# EAGLE design scanner (EAGLE 6.5.0)
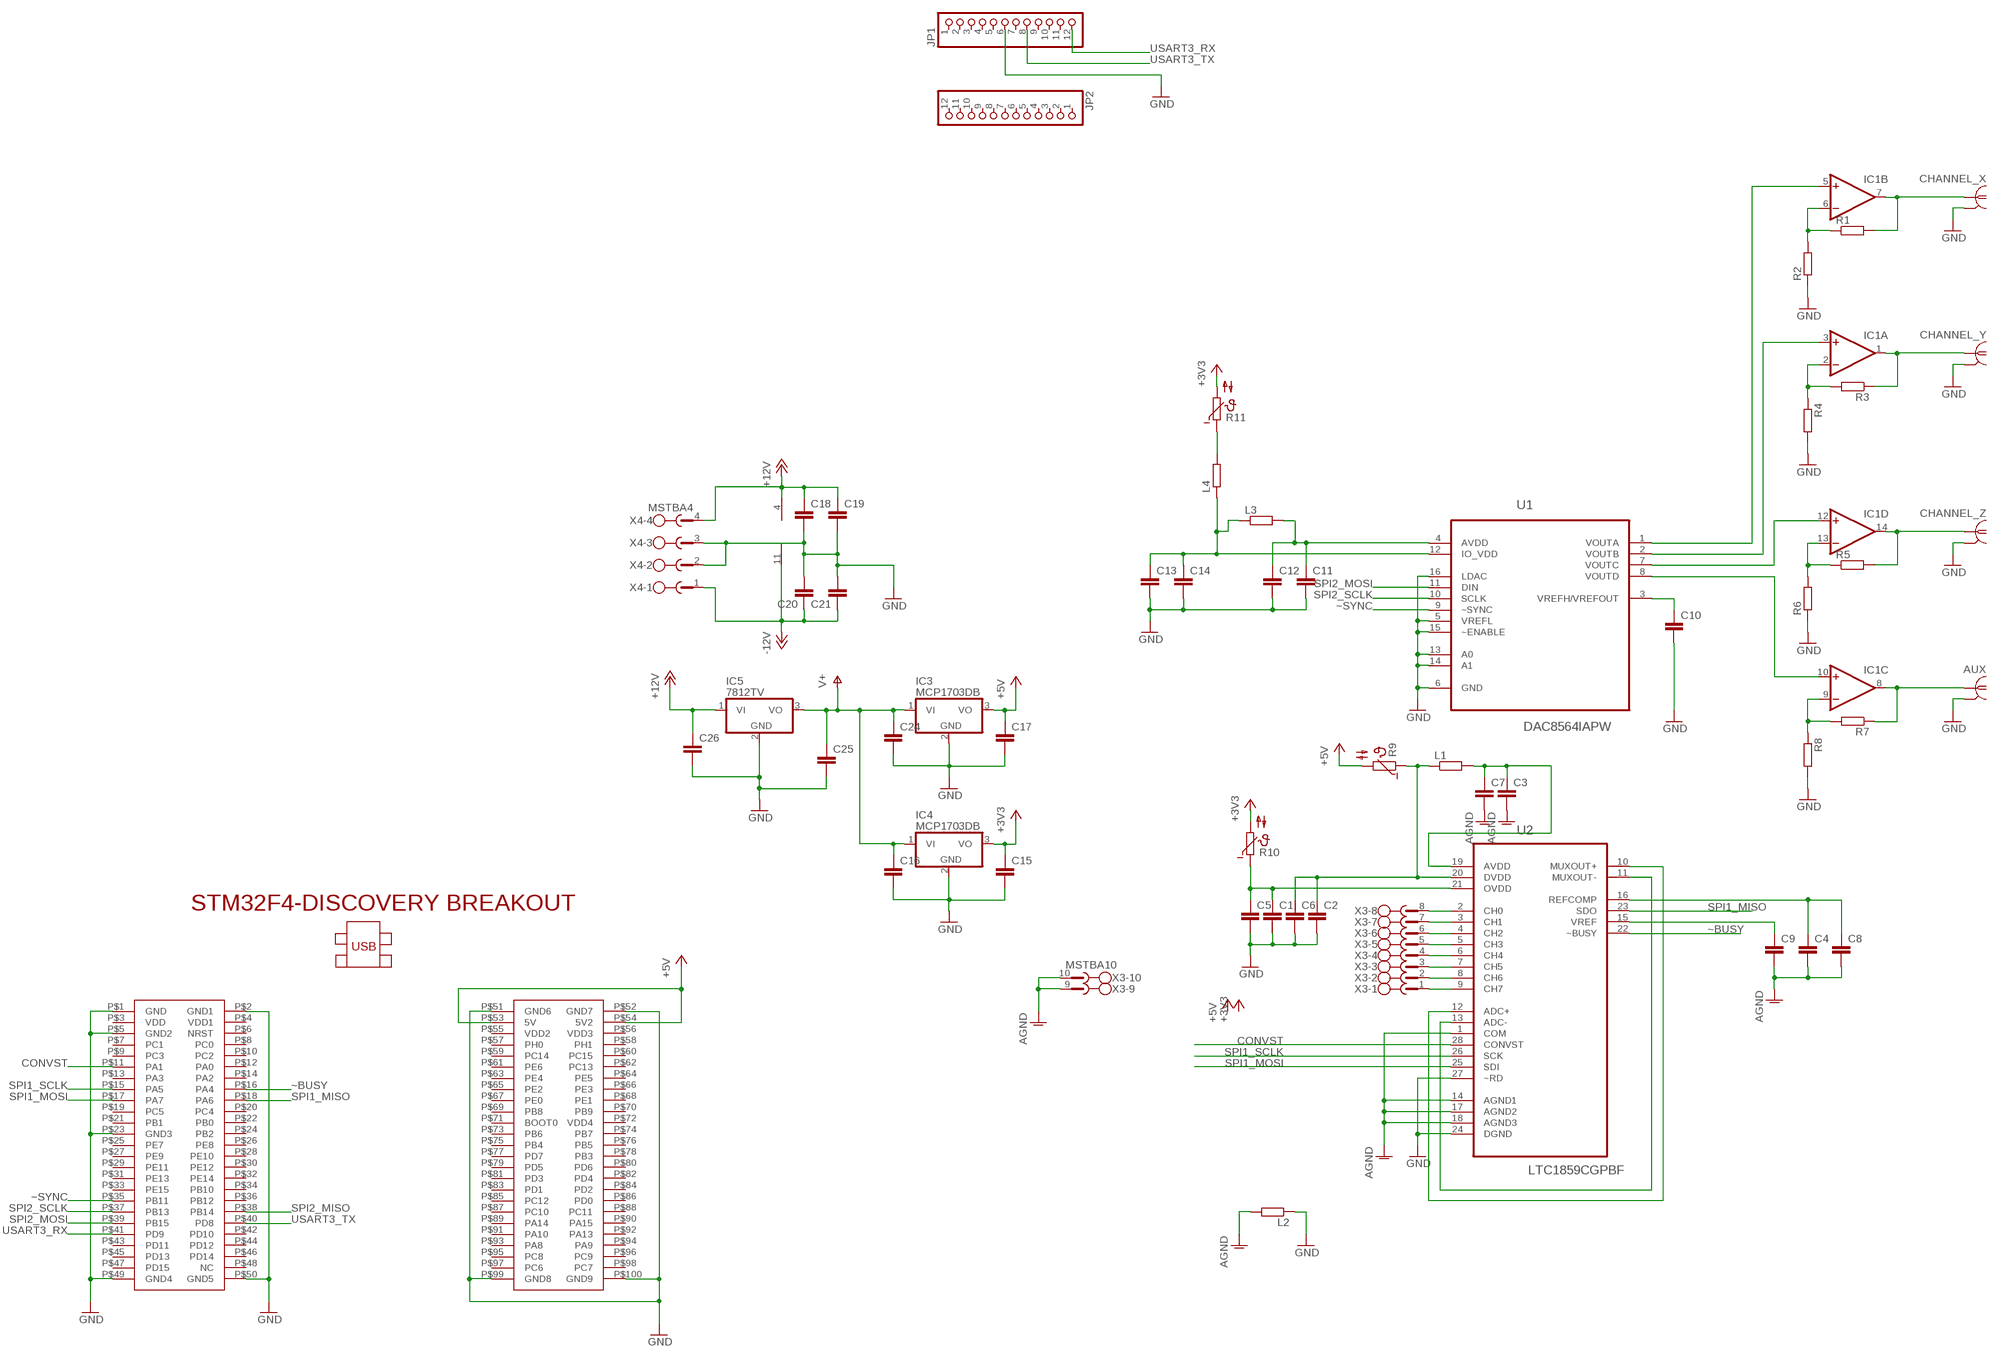
[diagram p0: schematic, sheet 1]

## Parts
AUX  1-227161-0  [AMP_227161]
C1  C-EUC0805  [C0805]
C2  C-EUC0805  [C0805]
C3  C-EUC0805  [C0805]
C4  C-EUC0805  [C0805]
C5  C-EUC1206  [C1206]
C6  C-EUC1206  [C1206]
C7  C-EUC1206  [C1206]
C8  C-EUC1206  [C1206]
C9  C-EUC1206  [C1206]
C10  C-EUC0805  [C0805]
C11  C-EUC0805  [C0805]
C12  C-EUC1206  [C1206]
C13  C-EUC1206  [C1206]
C14  C-EUC0805  [C0805]
C15  C-EUC0805  [C0805]
C16  C-EUC0805  [C0805]
C17  C-EUC0805  [C0805]
C18  C-EUC1206  [C1206]
C19  C-EUC0805  [C0805]
C20  C-EUC1206  [C1206]
C21  C-EUC0805  [C0805]
C24  C-EUC0805  [C0805]
C25  C-EUC1206  [C1206]
C26  C-EUC1206  [C1206]
CHANNEL_X  1-227161-0  [AMP_227161]
CHANNEL_Y  1-227161-0  [AMP_227161]
CHANNEL_Z  1-227161-0  [AMP_227161]
IC1  4AMP_P4+11D  [SO14]
IC3  MCP1703DB  [SOT223]
IC4  MCP1703DB  [SOT223]
IC5  7812TV  [TO220V]
JP1  PINHD-1X12  [1X12]
JP2  PINHD-1X12  [1X12]
L1  R-EU_M1206  [M1206]
L2  R-EU_M1206  [M1206]
L3  R-EU_M1206  [M1206]
L4  R-EU_M1206  [M1206]
R1  R-EU_M0805  [M0805]
R2  R-EU_M0805  [M0805]
R3  R-EU_M0805  [M0805]
R4  R-EU_M0805  [M0805]
R5  R-EU_M0805  [M0805]
R6  R-EU_M0805  [M0805]
R7  R-EU_M0805  [M0805]
R8  R-EU_M0805  [M0805]
R9  NTC644C  [N644C]
R10  NTC644C  [N644C]
R11  NTC644C  [N644C]
U1  DAC8564IAPW  [SOP65P640X120-16N]
U2  LTC1859CGPBF  [SOP65P780X200-28N]
U$2  STM32F4-DISCOVERY  [STM32F4-DISCOVERY]
X3  MSTBA10  [MSTBA10]
X4  MSTBA4  [MSTBA4]

## Nets
+3V3: C15.1 IC4.3(VO) R10.2 R11.2
+5V: C17.1 IC3.3(VO) R9.2 U$2.P$53(5V) U$2.P$54(5V2)
+12V: C18.1 C19.1 C26.1 IC1.4(P:V+) IC5.1(VI) X4.4
-12V: C20.1 C21.1 IC1.11(P:V-) X4.1
AGND: C3.2 C4.2 C7.2 C8.2 C9.2 L2.2 U2.1(COM) U2.14(AGND1) U2.17(AGND2) U2.18(AGND3) X3.9 X3.10
AVCC: C3.1 C7.1 L1.2 U2.19(AVDD)
CONVST: U2.28(CONVST) U$2.P$11(PA1)
GND: AUX.2 C1.2 C2.2 C5.2 C6.2 C10.2 C11.2 C12.2 C13.2 C14.2 C15.2 C16.2 C17.2 C18.2 C19.2 C20.2 C21.2 C24.2 C25.2 C26.2 CHANNEL_X.2 CHANNEL_Y.2 CHANNEL_Z.2 IC3.2(GND) IC4.2(GND) IC5.2(GND) JP1.6 L2.1 R2.1 R4.2 R6.1 R8.2 U1.5(VREFL) U1.6(GND) U1.13(A0) U1.14(A1) U1.15(~ENABLE) U1.16(LDAC) U2.24(DGND) U2.27(~RD) U$2.P$1(GND) U$2.P$2(GND1) U$2.P$5(GND2) U$2.P$23(GND3) U$2.P$49(GND4) U$2.P$50(GND5) U$2.P$51(GND6) U$2.P$52(GND7) U$2.P$99(GND8) U$2.P$100(GND9) X4.2 X4.3
N$1: U2.10(MUXOUT+) U2.12(ADC+)
N$2: U2.11(MUXOUT-) U2.13(ADC-)
N$3: IC1.5(B:+IN) U1.1(VOUTA)
N$4: C9.1 U2.15(VREF)
N$5: C4.1 C8.1 U2.16(REFCOMP)
N$6: U2.3(CH1) X3.7
N$7: U2.2(CH0) X3.8
N$8: U2.4(CH2) X3.6
N$9: U2.5(CH3) X3.5
N$10: U2.6(CH4) X3.4
N$11: U2.7(CH5) X3.3
N$12: U2.8(CH6) X3.2
N$13: U2.9(CH7) X3.1
N$14: IC1.3(A:+IN) U1.2(VOUTB)
N$15: IC1.12(D:+IN) U1.7(VOUTC)
N$16: IC1.10(C:+IN) U1.8(VOUTD)
N$17: C10.1 U1.3(VREFH/VREFOUT)
N$18: CHANNEL_X.1 IC1.7(B:OUT) R1.2
N$19: IC1.6(B:-IN) R1.1 R2.2
N$20: CHANNEL_Y.1 IC1.1(A:OUT) R3.1
N$21: IC1.2(A:-IN) R3.2 R4.1
N$22: C13.1 C14.1 L3.1 L4.1 U1.12(IO_VDD)
N$23: CHANNEL_Z.1 IC1.14(D:OUT) R5.2
N$24: IC1.13(D:-IN) R5.1 R6.2
N$25: AUX.1 IC1.8(C:OUT) R7.1
N$26: IC1.9(C:-IN) R7.2 R8.1
N$27: C11.1 C12.1 L3.2 U1.4(AVDD)
N$28: L4.2 R11.1
N$29: C2.1 C6.1 L1.1 R9.1 U2.20(DVDD)
N$30: C1.1 C5.1 R10.1 U2.21(OVDD)
SPI1_MISO: U2.23(SDO) U$2.P$18(PA6)
SPI1_MOSI: U2.25(SDI) U$2.P$17(PA7)
SPI1_SCLK: U2.26(SCK) U$2.P$15(PA5)
SPI2_MISO: U$2.P$38(PB14)
SPI2_MOSI: U1.11(DIN) U$2.P$39(PB15)
SPI2_SCLK: U1.10(SCLK) U$2.P$37(PB13)
USART3_RX: JP1.12 U$2.P$41(PD9)
USART3_TX: JP1.8 U$2.P$40(PD8)
V+: C16.1 C24.1 C25.1 IC3.1(VI) IC4.1(VI) IC5.3(VO)
~BUSY: U2.22(~BUSY) U$2.P$16(PA4)
~SYNC: U1.9(~SYNC) U$2.P$35(PB11)
Unconnected: JP1.1 JP1.2 JP1.3 JP1.4 JP1.5 JP1.7 JP1.9 JP1.10 JP1.11 JP2.1 JP2.2 JP2.3 JP2.4 JP2.5 JP2.6 JP2.7 JP2.8 JP2.9 JP2.10 JP2.11 JP2.12 U$2.P$3(VDD) U$2.P$4(VDD1) U$2.P$6(NRST) U$2.P$7(PC1) U$2.P$8(PC0) U$2.P$9(PC3) U$2.P$10(PC2) U$2.P$12(PA0) U$2.P$13(PA3) U$2.P$14(PA2) U$2.P$19(PC5) U$2.P$20(PC4) U$2.P$21(PB1) U$2.P$22(PB0) U$2.P$24(PB2) U$2.P$25(PE7) U$2.P$26(PE8) U$2.P$27(PE9) U$2.P$28(PE10) U$2.P$29(PE11) U$2.P$30(PE12) U$2.P$31(PE13) U$2.P$32(PE14) U$2.P$33(PE15) U$2.P$34(PB10) U$2.P$36(PB12) U$2.P$42(PD10) U$2.P$43(PD11) U$2.P$44(PD12) U$2.P$45(PD13) U$2.P$46(PD14) U$2.P$47(PD15) U$2.P$48(NC) U$2.P$55(VDD2) U$2.P$56(VDD3) U$2.P$57(PH0) U$2.P$58(PH1) U$2.P$59(PC14) U$2.P$60(PC15) U$2.P$61(PE6) U$2.P$62(PC13) U$2.P$63(PE4) U$2.P$64(PE5) U$2.P$65(PE2) U$2.P$66(PE3) U$2.P$67(PE0) U$2.P$68(PE1) U$2.P$69(PB8) U$2.P$70(PB9) U$2.P$71(BOOT0) U$2.P$72(VDD4) U$2.P$73(PB6) U$2.P$74(PB7) U$2.P$75(PB4) U$2.P$76(PB5) U$2.P$77(PD7) U$2.P$78(PB3) U$2.P$79(PD5) U$2.P$80(PD6) U$2.P$81(PD3) U$2.P$82(PD4) U$2.P$83(PD1) U$2.P$84(PD2) U$2.P$85(PC12) U$2.P$86(PD0) U$2.P$87(PC10) U$2.P$88(PC11) U$2.P$89(PA14) U$2.P$90(PA15) U$2.P$91(PA10) U$2.P$92(PA13) U$2.P$93(PA8) U$2.P$94(PA9) U$2.P$95(PC8) U$2.P$96(PC9) U$2.P$97(PC6) U$2.P$98(PC7)

## Library data of the parts
AUX CHANNEL_X CHANNEL_Y CHANNEL_Z = con-coax:?227161*: JACK, RIGHT ANGLE, 50 OHM, PCB, BNC Source: amp_227161.pdf; MF: TYCO ELECTRONICS; MPN: 1-227161; OC_FARNELL: unknown; OC_NEWARK: 33B3200
C1-C21 C24-C26 = resistor:C-EU: CAPACITOR, European symbol
IC1 = linear:4AMP_P4+11: OP AMP
IC3 IC4 = linear:MCP1703: 250 mA, 16V, Low Quiescent Current LDO Regulator Source: http://ww1.microchip.com/downloads/en/DeviceDoc/22049b.pdf
IC5 = linear:78*: Positive VOLTAGE REGULATOR Source: http://cache.national.com/ds/LM/LM78L05.pdf http://www.fairchildsemi.com/ds/LM/LM7805.pdf
JP1 JP2 = pinhead:PINHD-1X12: PIN HEADER
L1-L4 R1-R8 = resistor:R-EU_: RESISTOR, European symbol
R9-R11 = ptc-ntc:NTC644C: PHILIPS NTC; OC_FARNELL: unknown; OC_NEWARK: unknown
U1 = DAC8564:DAC8564IAPW: DAC; MPN: DAC8564IAPW; OC_FARNELL: 1536691; OC_NEWARK: 65M0703; PACKAGE: TSSOP-16; SUPPLIER: Texas Instruments
U2 = ltc1859:LTC1859CGPBF: 16 Bit ADC; MPN: LTC1859CG#PBF; OC_FARNELL: 1898592; OC_NEWARK: 56M4002; PACKAGE: SSOP-28; SUPPLIER: Linear Technology
U$2 = stm32full:STM32F4-DISCOVERY
X3 = con-phoenix-508:MSTBA10: PHOENIX; MF: FARNELL; MPN: 1757323; OC_FARNELL: 3705249; OC_NEWARK: 71C4168
X4 = con-phoenix-508:MSTBA4: PHOENIX; MF: FARNELL; MPN: 1757268; OC_FARNELL: 3705195; OC_NEWARK: 71C4163

## Board
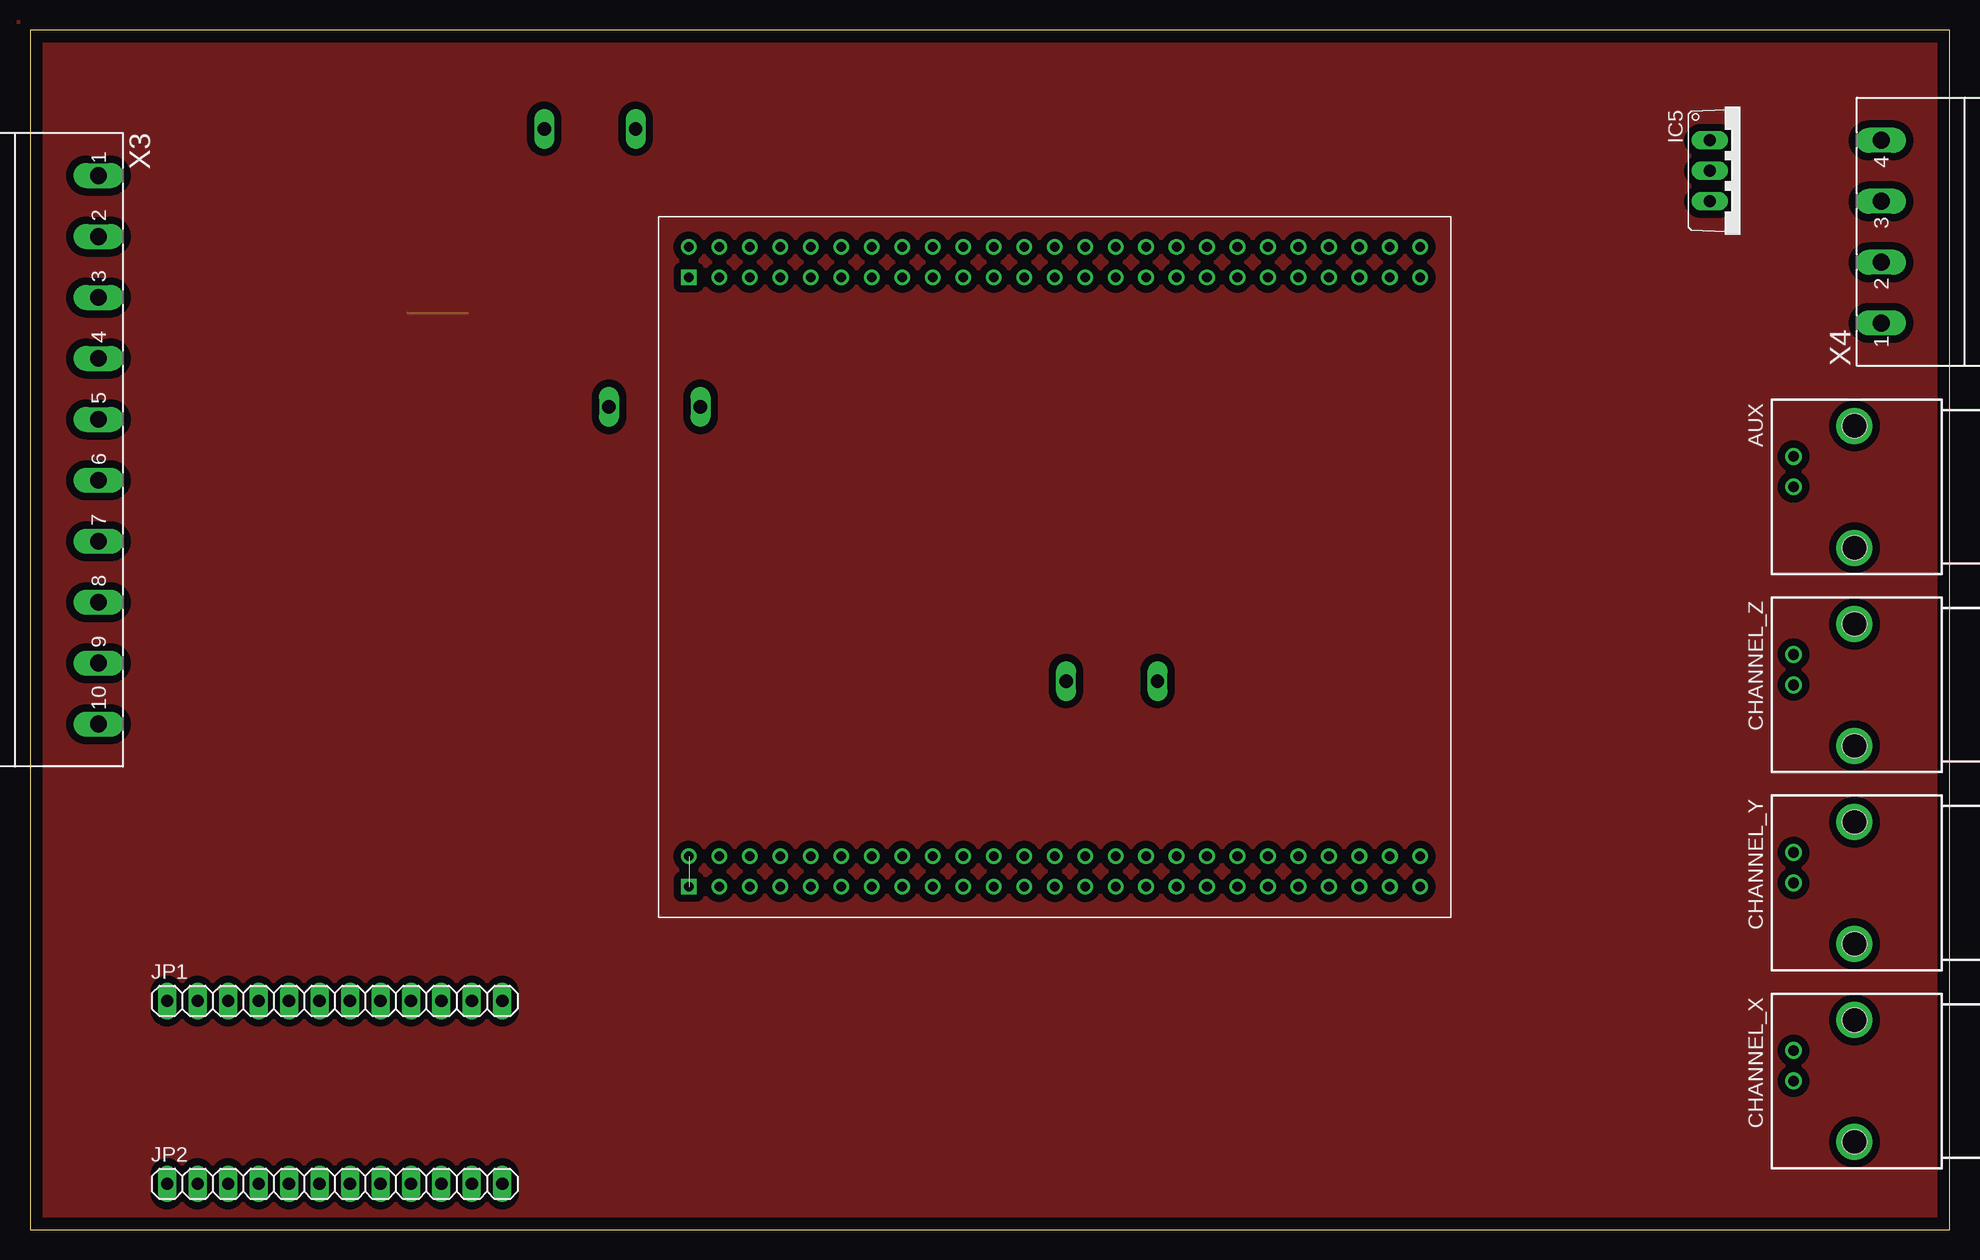
[diagram p1: board, top side]
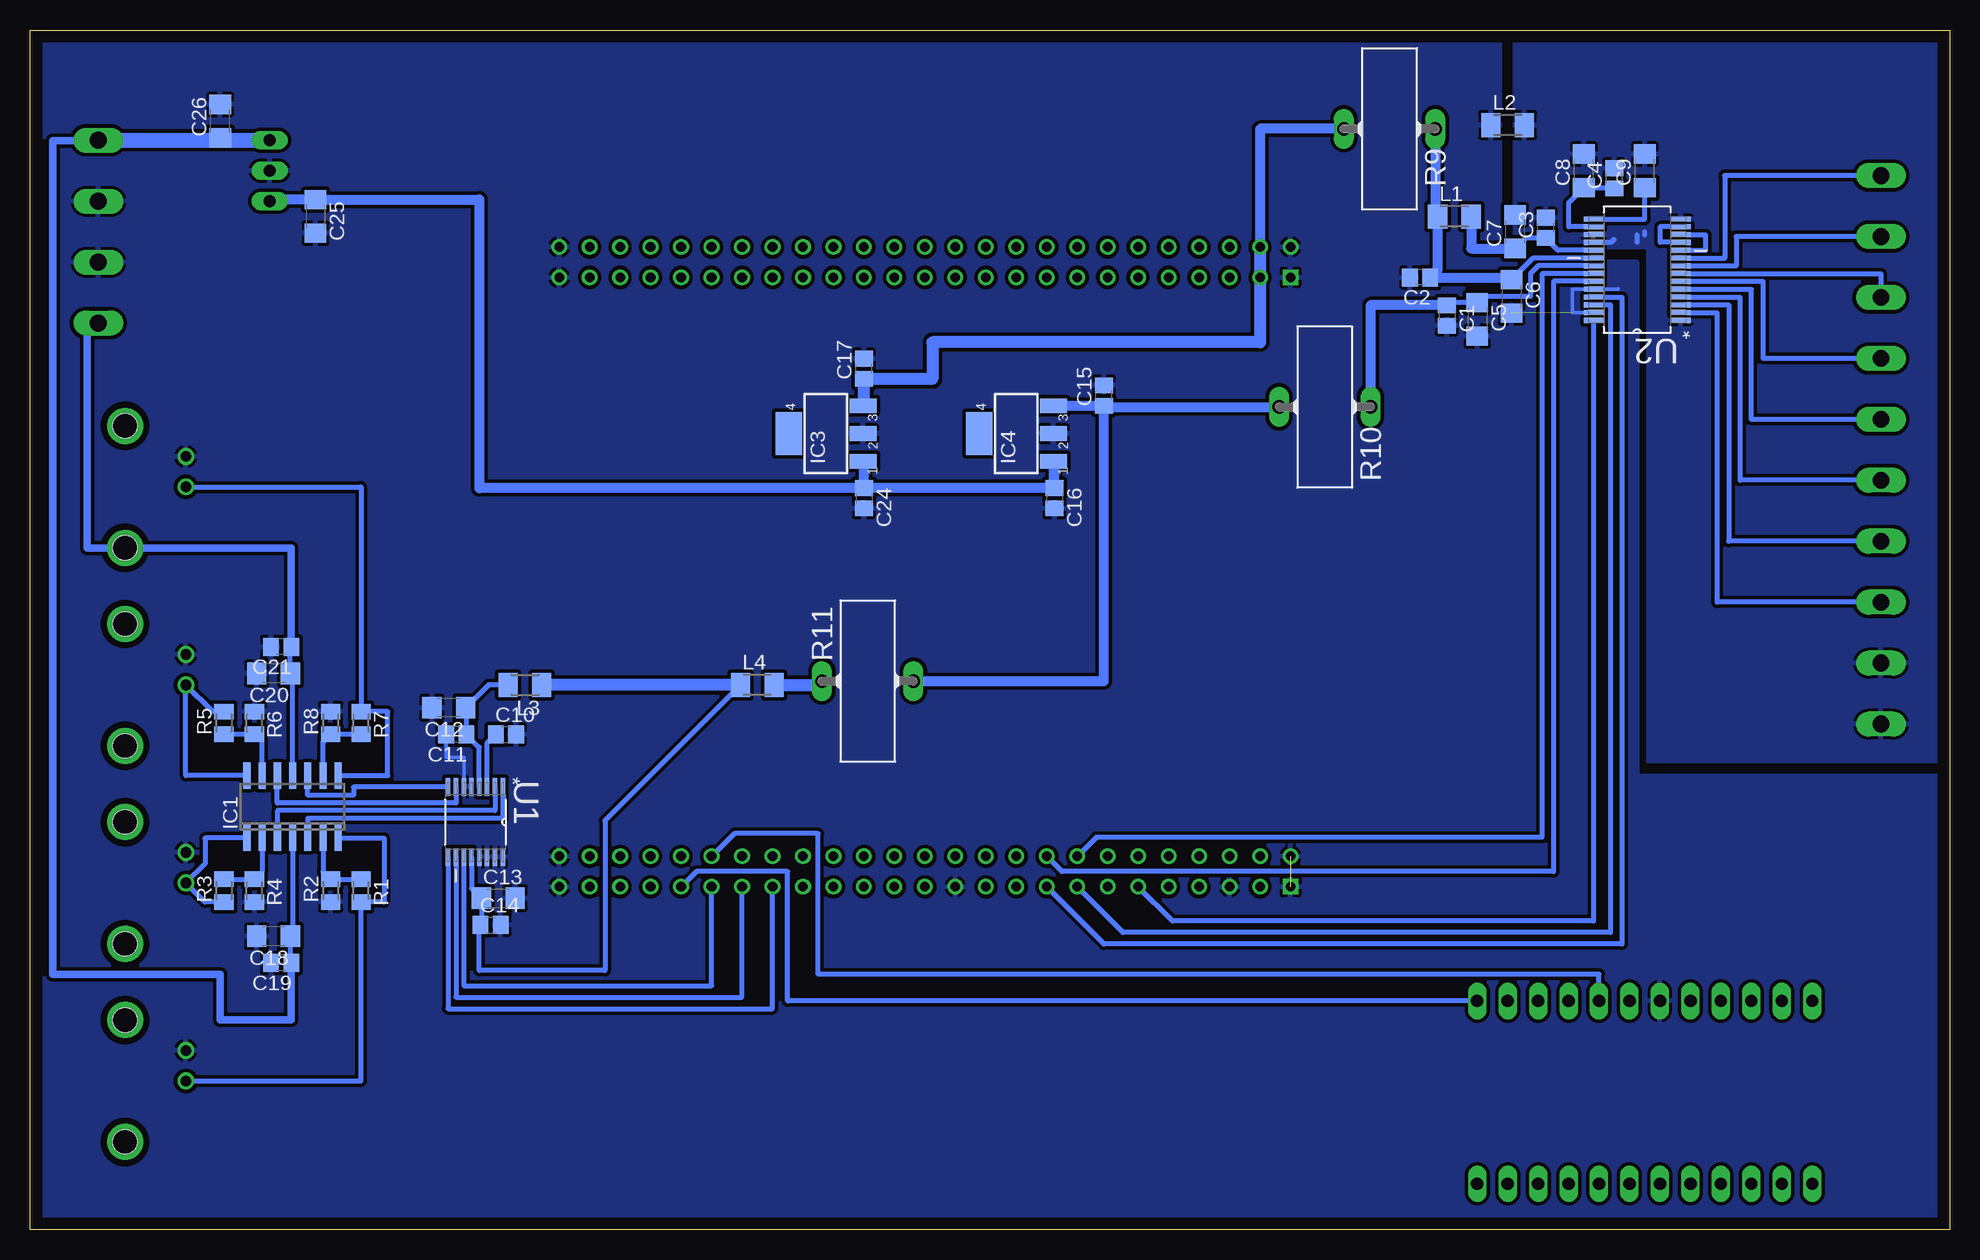
[diagram p2: board, bottom side, seen from below]

Size 160 x 100 mm. Coordinates in mm from the lower left corner, seen from the top.
Outline: 0,0 160,0 160,100 0,100 0,0
Copper layers (1*16): Top 0.035mm / dielectric 1.5mm / Bottom 0.035mm
Design rules "default": minimum track width 10mil, minimum drill 24mil, track to track 8mil, track to pad 8mil, pad to pad 8mil, via to via 8mil, smd to smd 8mil, copper to edge 40mil, drill to drill 8mil, minimum pad ring 10mil, minimum via ring 8mil, stop-mask expansion 4mil, vias tented up to drill 0mil, thermal gap 10mil

### Footprints (pad centres in the part's own frame; a part is rotated, then mirrored left to right if it is on the bottom)
AMP_227161 = drill 0.9 pad 1.27: 1 0,-5.08; 2 -2.54,-5.08 | drill 2: P$1 -5.08,0; P$2 5.08,0 | hole 2: -5.08,0; 5.08,0
C0805 = smd 1.3 x 1.5: 1 -0.85,0; 2 0.85,0
C1206 = smd 1.6 x 1.8: 1 -1.4,0; 2 1.4,0
SO14 = smd 0.6 x 2.2: 1 -3.81,-2.6; 2 -2.54,-2.6; 3 -1.27,-2.6; 4 0,-2.6; 5 1.27,-2.6; 6 2.54,-2.6; 7 3.81,-2.6; 8 3.81,2.6; 9 2.54,2.6; 10 1.27,2.6; 11 0,2.6; 12 -1.27,2.6; 13 -2.54,2.6; 14 -3.81,2.6
SOT223 = smd 1.219 x 2.235: 1 -2.311,-3.099; 2 0,-3.099; 3 2.311,-3.099 | smd 3.6 x 2.2: 4 0,3.099
TO220V = drill 1.016 long: 1 -2.54,-2.54; 2 0,-2.54; 3 2.54,-2.54
1X12 = drill 1.016 long: 1 -13.97,0; 2 -11.43,0; 3 -8.89,0; 4 -6.35,0; 5 -3.81,0; 6 -1.27,0; 7 1.27,0; 8 3.81,0; 9 6.35,0; 10 8.89,0; 11 11.43,0; 12 13.97,0
M1206 = smd 1.6 x 2: 1 -1.4,0; 2 1.4,0
M0805 = smd 1.3 x 1.6: 1 -0.95,0; 2 0.95,0
N644C = drill 1.118 long: 1 -3.81,0; 2 3.81,0
SOP65P640X120-16N = smd 1.473 x 0.356: 1 -2.921,2.286; 2 -2.921,1.626; 3 -2.921,0.965; 4 -2.921,0.33; 5 -2.921,-0.33; 6 -2.921,-0.965; 7 -2.921,-1.626; 8 -2.921,-2.286; 9 2.921,-2.286; 10 2.921,-1.626; 11 2.921,-0.965; 12 2.921,-0.33; 13 2.921,0.33; 14 2.921,0.965; 15 2.921,1.626; 16 2.921,2.286
SOP65P780X200-28N = smd 1.651 x 0.432: 1 -3.632,4.216; 2 -3.632,3.581; 3 -3.632,2.921; 4 -3.632,2.286; 5 -3.632,1.626; 6 -3.632,0.965; 7 -3.632,0.33; 8 -3.632,-0.33; 9 -3.632,-0.965; 10 -3.632,-1.626; 11 -3.632,-2.286; 12 -3.632,-2.921; 13 -3.632,-3.581; 14 -3.632,-4.216; 15 3.632,-4.216; 16 3.632,-3.581; 17 3.632,-2.921; 18 3.632,-2.286; 19 3.632,-1.626; 20 3.632,-0.965; 21 3.632,-0.33; 22 3.632,0.33; 23 3.632,0.965; 24 3.632,1.626; 25 3.632,2.286; 26 3.632,2.921; 27 3.632,3.581; 28 3.632,4.216
STM32F4-DISCOVERY = drill 0.8 square: P$1 -27.94,30.48; P$51 22.86,30.48 | drill 0.8: P$2 -25.4,30.48; P$3 -27.94,27.94; P$4 -25.4,27.94; P$5 -27.94,25.4; P$6 -25.4,25.4; P$7 -27.94,22.86; P$8 -25.4,22.86; P$9 -27.94,20.32; P$10 -25.4,20.32; P$11 -27.94,17.78; P$12 -25.4,17.78; P$13 -27.94,15.24; P$14 -25.4,15.24; P$15 -27.94,12.7; P$16 -25.4,12.7; P$17 -27.94,10.16; P$18 -25.4,10.16; P$19 -27.94,7.62; P$20 -25.4,7.62; P$21 -27.94,5.08; P$22 -25.4,5.08; P$23 -27.94,2.54; P$24 -25.4,2.54; P$25 -27.94,0; P$26 -25.4,0; P$27 -27.94,-2.54; P$28 -25.4,-2.54; P$29 -27.94,-5.08; P$30 -25.4,-5.08; P$31 -27.94,-7.62; P$32 -25.4,-7.62; P$33 -27.94,-10.16; P$34 -25.4,-10.16; P$35 -27.94,-12.7; P$36 -25.4,-12.7; P$37 -27.94,-15.24; P$38 -25.4,-15.24; P$39 -27.94,-17.78; P$40 -25.4,-17.78; P$41 -27.94,-20.32; P$42 -25.4,-20.32; P$43 -27.94,-22.86; P$44 -25.4,-22.86; P$45 -27.94,-25.4; P$46 -25.4,-25.4; P$47 -27.94,-27.94; P$48 -25.4,-27.94; P$49 -27.94,-30.48; P$50 -25.4,-30.48; P$52 25.4,30.48; P$53 22.86,27.94; P$54 25.4,27.94; P$55 22.86,25.4; P$56 25.4,25.4; P$57 22.86,22.86; P$58 25.4,22.86; P$59 22.86,20.32; P$60 25.4,20.32; P$61 22.86,17.78; P$62 25.4,17.78; P$63 22.86,15.24; P$64 25.4,15.24; P$65 22.86,12.7; P$66 25.4,12.7; P$67 22.86,10.16; P$68 25.4,10.16; P$69 22.86,7.62; P$70 25.4,7.62; P$71 22.86,5.08; P$72 25.4,5.08; P$73 22.86,2.54; P$74 25.4,2.54; P$75 22.86,0; P$76 25.4,0; P$77 22.86,-2.54; P$78 25.4,-2.54; P$79 22.86,-5.08; P$80 25.4,-5.08; P$81 22.86,-7.62; P$82 25.4,-7.62; P$83 22.86,-10.16; P$84 25.4,-10.16; P$85 22.86,-12.7; P$86 25.4,-12.7; P$87 22.86,-15.24; P$88 25.4,-15.24; P$89 22.86,-17.78; P$90 25.4,-17.78; P$91 22.86,-20.32; P$92 25.4,-20.32; P$93 22.86,-22.86; P$94 25.4,-22.86; P$95 22.86,-25.4; P$96 25.4,-25.4; P$97 22.86,-27.94; P$98 25.4,-27.94; P$99 22.86,-30.48; P$100 25.4,-30.48
MSTBA10 = drill 1.397 long: 1 -22.86,5.08; 2 -17.78,5.08; 3 -12.7,5.08; 4 -7.62,5.08; 5 -2.54,5.08; 6 2.54,5.08; 7 7.62,5.08; 8 12.7,5.08; 9 17.78,5.08; 10 22.86,5.08
MSTBA4 = drill 1.397 long: 1 -7.62,5.08; 2 -2.54,5.08; 3 2.54,5.08; 4 7.62,5.08

### Placement (x,y rotation side)
AUX  152.08,61.91 270 top
C1  41.91,76.2 270 bottom
C2  44.13,79.38 180 bottom
C3  33.66,83.5 90 bottom
C4  27.94,87.63 90 bottom
C5  39.37,75.88 270 bottom
C6  36.51,77.79 270 bottom
C7  36.2,83.19 90 bottom
C8  30.48,88.27 90 bottom
C9  25.4,88.27 90 bottom
C10  120.33,41.27 0 bottom
C11  124.46,41.27 180 bottom
C12  125.09,43.5 180 bottom
C13  120.97,27.62 0 bottom
C14  121.6,25.4 0 bottom
C15  70.48,69.53 90 bottom
C16  74.61,60.96 270 bottom
C17  90.49,71.75 90 bottom
C18  139.7,24.45 180 bottom
C19  139.06,22.23 180 bottom
C20  139.7,46.35 180 bottom
C21  139.06,48.58 180 bottom
C24  90.49,60.96 270 bottom
C25  136.21,84.45 270 bottom
C26  144.15,92.39 90 bottom
CHANNEL_X  152.08,12.38 270 top
CHANNEL_Y  152.08,28.89 270 top
CHANNEL_Z  152.08,45.4 270 top
IC1  138.11,35.24 0 bottom
IC3  93.66,66.36 90 bottom
IC4  77.79,66.36 90 bottom
IC5  142.56,88.27 270 top
JP1  25.4,19.05 0 top
JP2  25.4,3.81 0 top
L1  41.27,84.45 0 bottom
L2  36.83,92.08 0 bottom
L3  118.75,45.4 180 bottom
L4  99.38,45.4 0 bottom
R1  132.4,28.26 270 bottom
R2  134.94,28.26 90 bottom
R3  143.83,28.26 90 bottom
R4  141.29,28.26 270 bottom
R5  143.83,42.23 90 bottom
R6  141.29,42.23 270 bottom
R7  132.4,42.23 270 bottom
R8  134.94,42.23 90 bottom
R9  46.67,91.76 180 bottom
R10  52.07,68.58 180 bottom
R11  90.17,45.72 0 bottom
U1  122.87,33.97 270 bottom
U2  26.04,80.01 180 bottom
U$2  85.41,56.52 90 top
X3  0.64,65 270 top
X4  159.38,83.19 90 top

### Tracks (layer width: path | path; a pad name or v marks a point on that pad's centre or on a via)
+3V3
  Bottom 0.406: 74.61,68.67 IC4.3
  Bottom 0.813: 74.61,68.67 70.48,68.67 C15.1 | C15.1 70.38,68.58 R10.2 | R11.2 70.48,45.72 C15.1
+5V
  Bottom 0.813: R9.2 57.47,91.76 U$2.P$54
  Bottom 1.016: U$2.P$54 U$2.P$53 57.47,73.98 84.77,73.98 84.77,70.91 C17.1 90.49,68.67 IC3.3
+12V
  Bottom 0.406: IC1.4 138.11,24.45 C18.1 138.3,22.23 C19.1
  Bottom 0.61: C19.1 138.22,17.46 144.15,17.46 144.15,21.27 158.12,21.27 158.12,90.78 154.01,90.78 X4.4
  Bottom 0.813: C26.1 140.02,90.99 IC5.1
  Bottom 1.27: X4.4 IC5.1
-12V
  Bottom 0.406: IC1.11 138.11,46.35 C20.1 138.3,48.58 C21.1
  Bottom 0.61: C21.1 138.22,56.83 155.23,56.83 155.23,75.56 X4.1
AGND
  Bottom 0.406: 25.4,82.93 25.4,83.19 | 26.04,82.3 26.04,82.93 | 27.94,82.55 28.19,82.3 U2.18
  pour Bottom (isolate 0.305): 0,39.05 25.08,39.05 25.08,81.92 36.2,81.92 36.2,99.69 0,99.69
AVCC
  Bottom 0.406: 36.11,81.7 C7.1 35.33,82.65 C3.1 32.64,81.64 U2.19
  Bottom 0.813: L1.2 39.88,81.78 C7.1
CONVST
  Bottom 0.406: U2.28 29.67,25.72 64.77,25.72 U$2.P$11
GND  (2 unrouted)
  Bottom 0.305: U2.27 31.43,76.43 31.43,78.38 U2.24 27.62,78.38 27.62,78.42 | U1.6 123.83,36.89 123.83,39.37 125.31,39.37 C11.2
  pour Bottom (isolate 0.305): 37.47,100.01 160.02,100.01 160.02,0 0,0 0,37.78 26.04,37.78 26.04,80.64 37.47,80.64
N$1
  Bottom 0.406: U2.12 20.32,82.93 20.32,81.64 U2.10
N$2
  Bottom 0.406: U2.13 24.13,83.59 24.13,82.3 U2.11
N$3
  Bottom 0.406: U1.1 120.59,34.29 136.84,34.29 IC1.5
N$4
  Bottom 0.406: U2.15 25.4,84.23 C9.1
N$5
  Bottom 0.406: U2.16 31.75,83.59 31.75,85.59 C8.1 28.02,86.86 C4.1
N$6
  Bottom 0.406: U2.3 18.41,77.09 18.41,57.38 X3.7
N$7
  Bottom 0.406: U2.2 19.37,76.43 19.37,52.3 X3.8
N$8
  Bottom 0.406: U2.4 17.46,77.72 17.46,62.46 X3.6
N$9
  Bottom 0.406: U2.5 16.51,78.38 16.51,67.54 X3.5
N$10
  Bottom 0.406: U2.6 15.56,79.05 15.56,72.62 X3.4
N$11
  Bottom 0.406: U2.7 5.71,79.68 X3.3
N$12
  Bottom 0.406: U2.8 17.78,80.34 17.78,82.78 X3.2
N$13
  Bottom 0.406: U2.9 18.73,80.97 18.73,87.86 X3.1
N$14
  Bottom 0.406: U1.2 121.25,34.92 139.38,34.92 IC1.3
N$15
  Bottom 0.406: U1.7 124.5,35.56 139.38,35.56 IC1.12
N$16
  Bottom 0.406: U1.8 133.03,36.89 133.03,36.2 136.84,36.2 IC1.10
N$17
  Bottom 0.406: U1.3 121.91,40.55 C10.1
N$18
  Bottom 0.406: IC1.7 130.49,32.64 130.49,27.3 R1.2 132.4,12.38 CHANNEL_X.1
N$19
  Bottom 0.406: R1.1 R2.2 135.57,29.84 IC1.6
N$20
  Bottom 0.406: IC1.1 145.41,32.64 145.41,30.48 CHANNEL_Y.1 145.42,27.31 R3.1
N$21
  Bottom 0.406: R3.2 R4.1 140.65,29.84 IC1.2
N$22
  Bottom 0.406: U1.12 123.2,28.46 C13.1 122.37,25.48 C14.1 122.56,25.3 122.56,21.59 112.08,21.59 112.08,34.1 L4.1
  Bottom 1.016: L4.1 L3.1
N$23
  Bottom 0.406: IC1.14 147,37.84 CHANNEL_Z.1 144.78,43.18 R5.2
N$24
  Bottom 0.406: IC1.13 140.65,40.64 R6.2 R5.1
N$25
  Bottom 0.406: IC1.8 130.18,37.84 130.18,43.18 R7.1 132.4,61.91 AUX.1
N$26
  Bottom 0.406: R7.2 R8.1 135.57,40.64 IC1.9
N$27
  Bottom 0.406: U1.4 122.54,40.21 C11.1 123.61,43.41 C12.1 121.79,45.4 L3.2
N$28
  Bottom 1.016: L4.2 93.98,45.4 R11.1
N$29
  Bottom 0.406: U2.20 34.73,80.97 C6.1
  Bottom 0.813: C6.1 36.51,79.38 C2.1 42.67,79.98 L1.1 42.86,84.45 R9.1
N$30
  Bottom 0.406: U2.21 34.28,80.34 34.92,79.69 34.92,77.79 38.55,77.79 C5.1 41.68,77.28 C1.1
  Bottom 0.813: C1.1 48.26,77.05 R10.1
N$31
  pour Top (isolate 0.61): 160.34,0 160.34,100.65 -0.95,100.65 -0.95,0
SPI1_MISO
  Bottom 0.406: U2.23 33.02,79.05 33.02,29.84 73.98,29.84 U$2.P$18
SPI1_MOSI
  Bottom 0.406: U2.25 27.3,77.72 27.3,23.81 70.48,23.81 U$2.P$17
SPI1_SCLK
  Bottom 0.406: U2.26 28.26,77.09 28.26,24.77 68.9,24.77 U$2.P$15
SPI2_MOSI
  Bottom 0.406: U1.11 123.84,20.32 103.19,20.32 U$2.P$39
SPI2_SCLK
  Bottom 0.406: U1.10 124.5,19.37 100.65,19.37 U$2.P$37
USART3_RX
  Bottom 0.406: JP1.12 96.84,19.05 96.84,29.84 104.46,29.84 U$2.P$41
USART3_TX
  Bottom 0.406: JP1.8 29.21,21.27 94.3,21.27 94.3,33.02 101.28,33.02 U$2.P$40
V+
  Bottom 0.813: C16.1 74.61,64.05 IC4.1 74.69,61.81 C24.1 | C24.1 90.49,64.05 IC3.1 | IC5.3 140.02,85.86 C25.1 122.56,85.86 122.56,61.81 C24.1
~BUSY
  Bottom 0.406: U2.22 33.97,79.68 33.97,32.7 71.12,32.7 U$2.P$16
~SYNC
  Bottom 0.406: U1.9 125.16,18.41 98.11,18.41 U$2.P$35